# EAGLE design untitled (EAGLE 6.1)
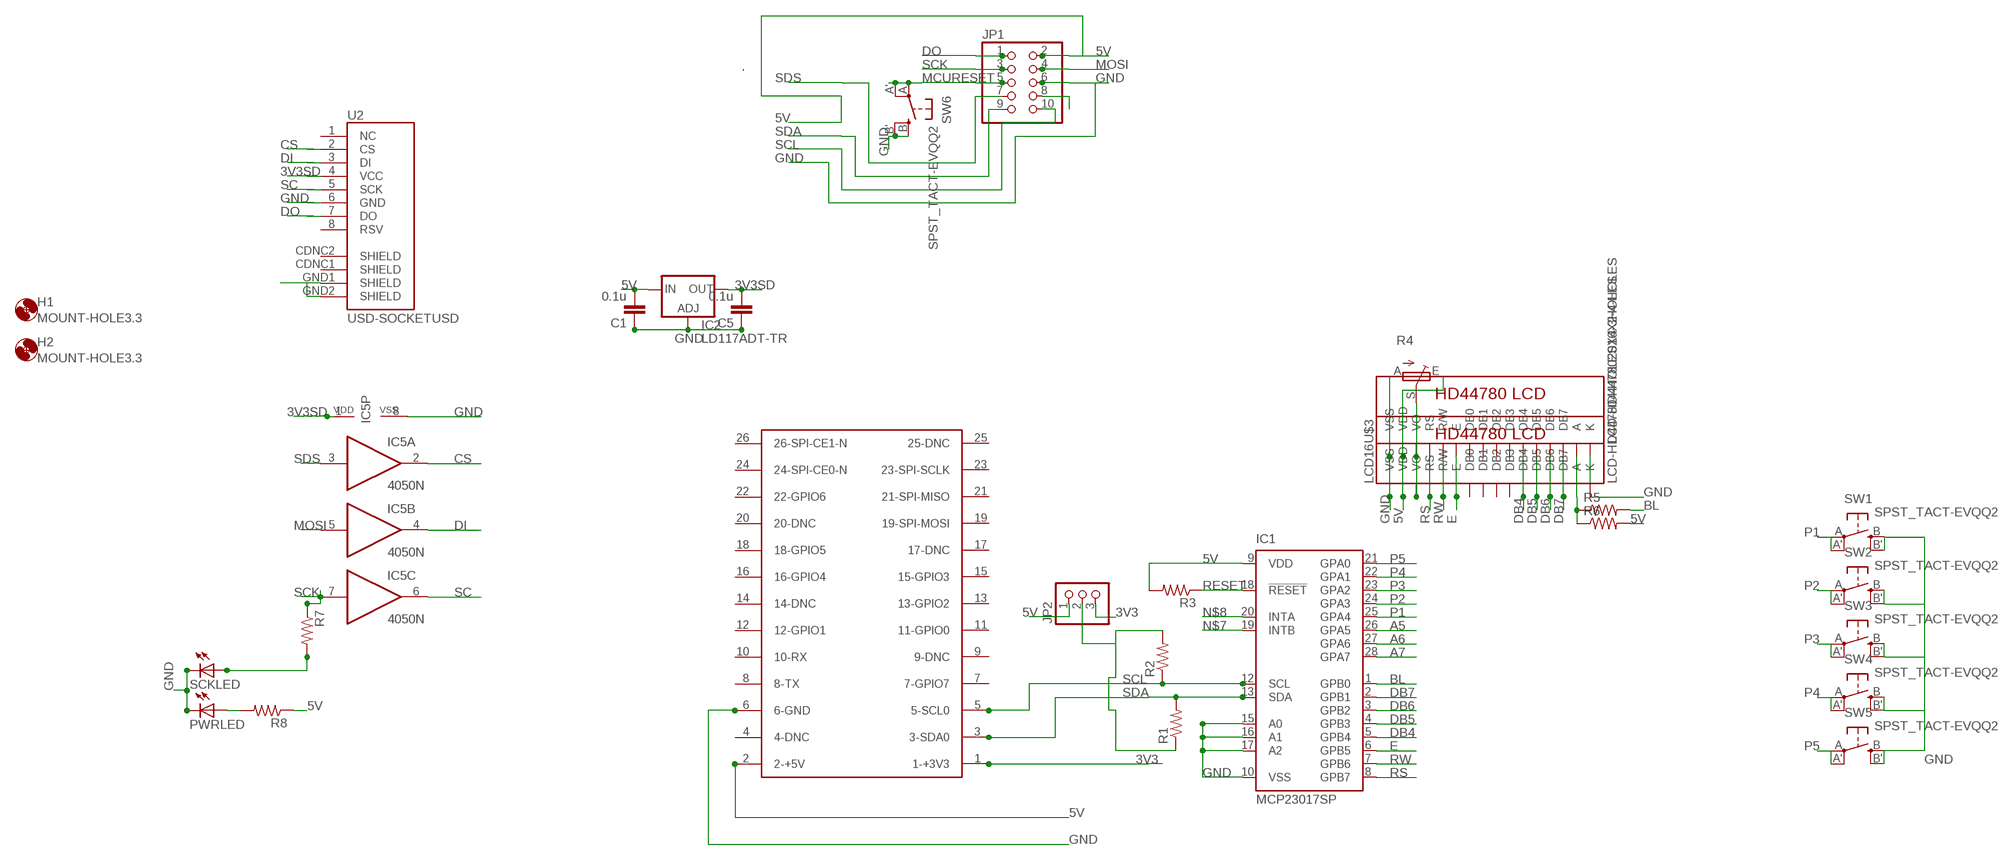
[diagram p0: schematic, sheet 1]

## Parts
C1  0.1u  CAPKIT  [CAP-PTH-SMALL-KIT]
C5  0.1u  CAPKIT  [CAP-PTH-SMALL-KIT]
H1  MOUNT-HOLE3.3  [3,3]
H2  MOUNT-HOLE3.3  [3,3]
IC1  MCP23017SP  [DIL28-3]
IC2  LD117ADT-TR  [DPACK]
IC5  4050N  [DIL16]
JP1  PINHD-2X5  [2X05]
JP2  PINHD-1X3  [1X03]
LCD16  LCD-HD447804-HOLES16X2-4-HOLES  [LCD-16X2-4HOLES]
PWRLED  LED1206  [LED-1206]
R1  R-US_0204/7  [0204/7]
R2  R-US_0204/7  [0204/7]
R3  R-US_0204/7  [0204/7]
R4  TRIM_EU-CA6V  [CA6V]
R5  R-US_0204/7  [0204/7]
R6  R-US_0204/7  [0204/7]
R7  R-US_0204/7  [0204/7]
R8  R-US_0204/7  [0204/7]
SCKLED  LED1206  [LED-1206]
SW1  SPST_TACT-EVQQ2  [EVQ-Q2]
SW2  SPST_TACT-EVQQ2  [EVQ-Q2]
SW3  SPST_TACT-EVQQ2  [EVQ-Q2]
SW4  SPST_TACT-EVQQ2  [EVQ-Q2]
SW5  SPST_TACT-EVQQ2  [EVQ-Q2]
SW6  SPST_TACT-EVQQ2  [EVQ-Q2]
U2  USD-SOCKETUSD  [USD-SOCKET-PP]
U$2  RASPBERRY-PI  [RASPBERRY-PI]
U$3  LCD-HD4478020X4-3HOLES  [LCD-20X4-3HOLES]

## Nets
3V3: JP2.3 U$2.1(1-+3V3)
3V3SD: C5.2 IC2.4(OUT) IC5.1(P:VDD) U2.4(VCC)
5V: C1.2 IC1.9(VDD) IC2.3(IN) JP1.2 JP2.1 LCD16.2(VDD) R3.2 R4.E R6.2 R8.1 U$2.2(2-+5V) U$3.P$2(VDD)
A5: IC1.26(GPA5)
A6: IC1.27(GPA6)
A7: IC1.28(GPA7)
BL: IC1.1(GPB0) R5.2
CS: IC5.2(A:O) U2.2(CS)
DB4: IC1.5(GPB4) LCD16.11(DB4) U$3.P$11(DB4)
DB5: IC1.4(GPB3) LCD16.12(DB5) U$3.P$12(DB5)
DB6: IC1.3(GPB2) LCD16.13(DB6) U$3.P$13(DB6)
DB7: IC1.2(GPB1) LCD16.14(DB7) U$3.P$14(DB7)
DI: IC5.4(B:O) U2.3(DI)
DO: JP1.1 U2.7(DO)
E: IC1.6(GPB5) LCD16.6(E) U$3.P$6(E)
GND: C1.1 C5.1 IC1.10(VSS) IC1.15(A0) IC1.16(A1) IC1.17(A2) IC2.1(ADJ) IC5.8(P:VSS) JP1.6 LCD16.1(VSS) LCD16.16(K) PWRLED.C R4.A SCKLED.C SW1.B'(S1) SW1.B(S) SW2.B'(S1) SW2.B(S) SW3.B'(S1) SW3.B(S) SW4.B'(S1) SW4.B(S) SW5.B'(S1) SW5.B(S) SW6.B'(S1) SW6.B(S) U2.6(GND) U2.GND1(SHIELD) U2.GND2(SHIELD) U$2.6(6-GND) U$3.P$1(VSS)
I2CPULL: JP2.2 R1.1 R2.2
MCURESET: JP1.5 SW6.A'(P1) SW6.A(P)
MOSI: IC5.5(B:I) JP1.4
N$1: LCD16.3(VO) R4.S U$3.P$3(VO)
N$2: LCD16.15(A) R5.1 R6.1 U$3.P$15(A)
N$3: JP1.8
N$4: U$3.P$16(K)
N$5: PWRLED.A R8.2
N$6: R7.2 SCKLED.A
N$7: IC1.19(INTB)
N$8: IC1.20(INTA)
P1: IC1.25(GPA4) SW1.A'(P1) SW1.A(P)
P2: IC1.24(GPA3) SW2.A'(P1) SW2.A(P)
P3: IC1.23(GPA2) SW3.A'(P1) SW3.A(P)
P4: IC1.22(GPA1) SW4.A'(P1) SW4.A(P)
P5: IC1.21(GPA0) SW5.A'(P1) SW5.A(P)
RESET: IC1.18(!RESET) R3.1
RS: IC1.8(GPB7) LCD16.4(RS) U$3.P$4(RS)
RW: IC1.7(GPB6) LCD16.5(R/W) U$3.P$5(R/W)
SC: IC5.6(C:O) U2.5(SCK)
SCK: IC5.7(C:I) JP1.3 R7.1
SCL: IC1.12(SCL) JP1.10 R2.1 U$2.5(5-SCL0)
SDA: IC1.13(SDA) JP1.9 R1.2 U$2.3(3-SDA0)
SDS: IC5.3(A:I) JP1.7
Unconnected: IC5.9(D:I) IC5.10(D:O) IC5.11(E:I) IC5.12(E:O) IC5.14(F:I) IC5.15(F:O) LCD16.7(DB0) LCD16.8(DB1) LCD16.9(DB2) LCD16.10(DB3) U2.1(NC) U2.8(RSV) U2.CDNC1(SHIELD) U2.CDNC2(SHIELD) U$2.4(4-DNC) U$2.7(7-GPIO7) U$2.8(8-TX) U$2.9(9-DNC) U$2.10(10-RX) U$2.11(11-GPIO0) U$2.12(12-GPIO1) U$2.13(13-GPIO2) U$2.14(14-DNC) U$2.15(15-GPIO3) U$2.16(16-GPIO4) U$2.17(17-DNC) U$2.18(18-GPIO5) U$2.19(19-SPI-MOSI) U$2.20(20-DNC) U$2.21(21-SPI-MISO) U$2.22(22-GPIO6) U$2.23(23-SPI-SCLK) U$2.24(24-SPI-CE0-N) U$2.25(25-DNC) U$2.26(26-SPI-CE1-N) U$3.P$7(DB0) U$3.P$8(DB1) U$3.P$9(DB2) U$3.P$10(DB3)

## Library data of the parts
C1 C5 = SparkFun-Passives:CAP: Capacitor Standard 0603 ceramic capacitor, and 0.1" leaded capacitor.
H1 H2 = holes:MOUNT-HOLE: MOUNTING HOLE with drill center marker
IC1 = adafruit:MCP23017: http://ww1.microchip.com/downloads/en/DeviceDoc/21952a.pdf Source: http://ww1.microchip.com/downloads/en/DeviceDoc/21952a.pdf
IC2 = v-reg:LD117A?*: Low drop fixed and adjustable positive voltage regulators 1 A Source: http://www.st.com/stonline/products/literature/ds/7194/ld1117axx.pdf
IC5 = 40xx:4050: Hex non-inverting BUFFER
JP1 = pinhead:PINHD-2X5: PIN HEADER
JP2 = pinhead:PINHD-1X3: PIN HEADER
LCD16 U$3 = HD44780LCD:LCD-HD44780
PWRLED SCKLED = LilyPad-Wearables:LED: LEDs Standard schematic elements and footprints for 5mm, 3mm, 1206, and 0603 sized LEDs. 5mm - Spark Fun Electronics SKU : Comp-SBL
R1-R3 R5-R8 = adafruit:R-US_: RESISTOR, American symbol
R4 = pot:TRIM_EU-: POTENTIOMETER
SW1-SW6 = adafruit:SPST_TACT: SMT 6mm switch, EVQQ2 series http://www.ladyada.net/library/eagle
U2 = SparkFun-Connectors_PETERMICROSDEBAY:USD-SOCKET: microSD Socket Push-push type uSD socket. Schematic element and footprint production proven. Spark Fun Electronics SKU : PRT-00127. tDoc lines correctly indicate media card edge positions when inserting (unlocked, locked, depressed).
U$2 = RaspberryPi:RASPBERRY-PI: Raspberry Pi Board <http://www.raspberrypi.org/> Jacques Lagnel V1.0 (beta) 2012 Board dimension: Forum 3D model <http://www.raspberrypi.org/forum/general-discussion/mechanical-profile-3d-models?value=3d%20model&type=1&include=1&search=1&ret=all> The GPIO Connector (P1): http://elinux.org/RPi_Low-level_peripherals

## Board
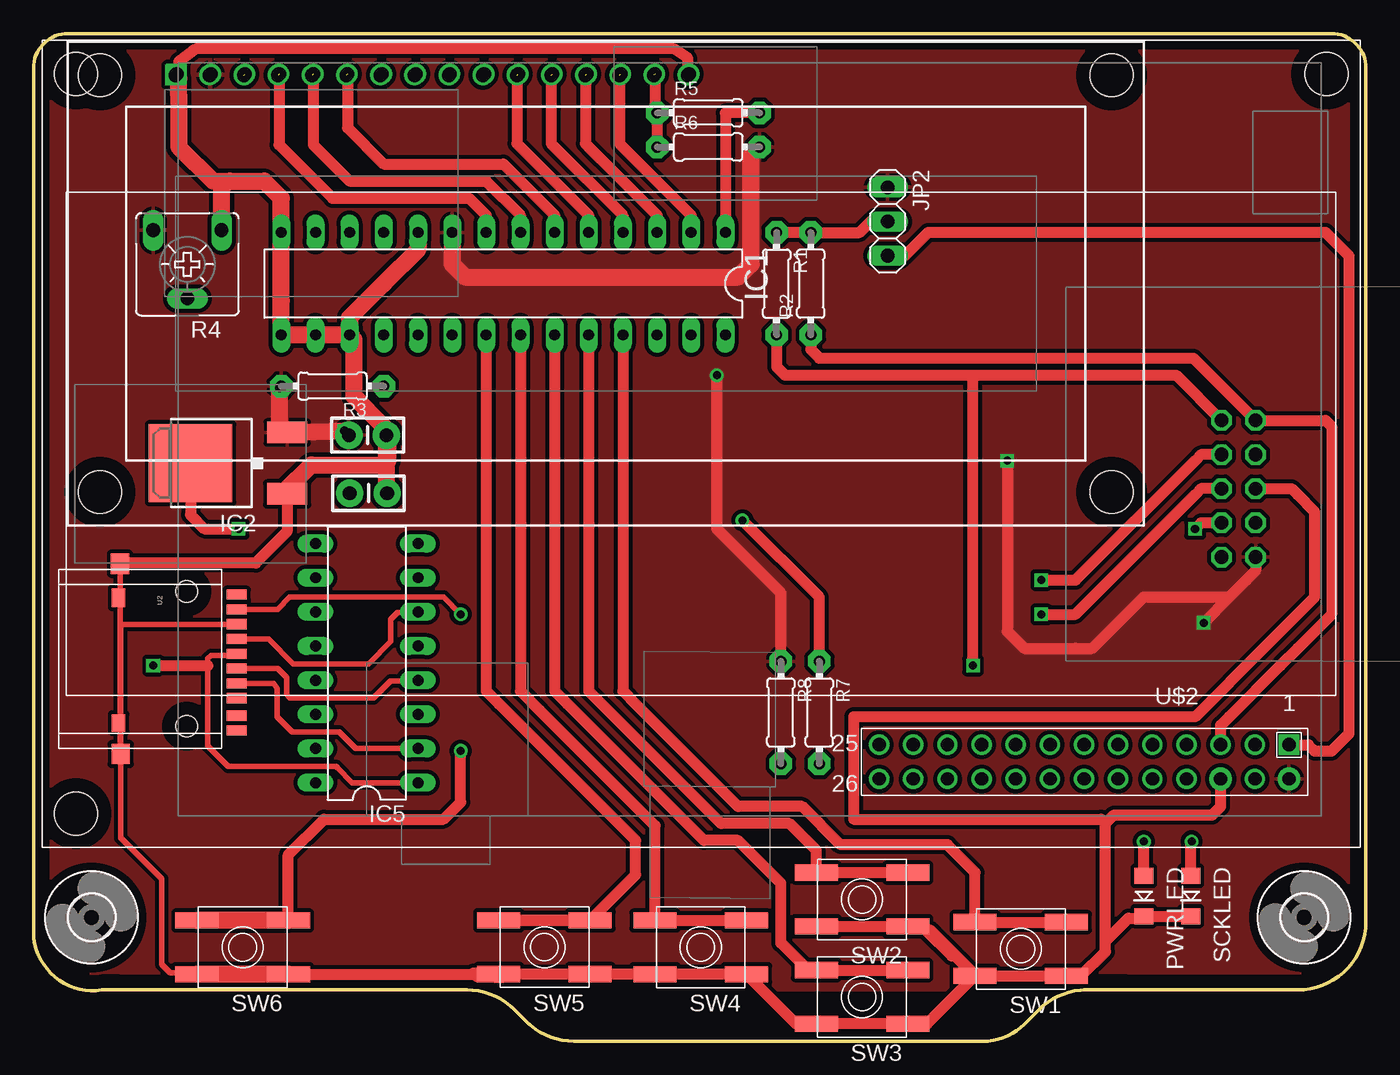
[diagram p1: board, top side]
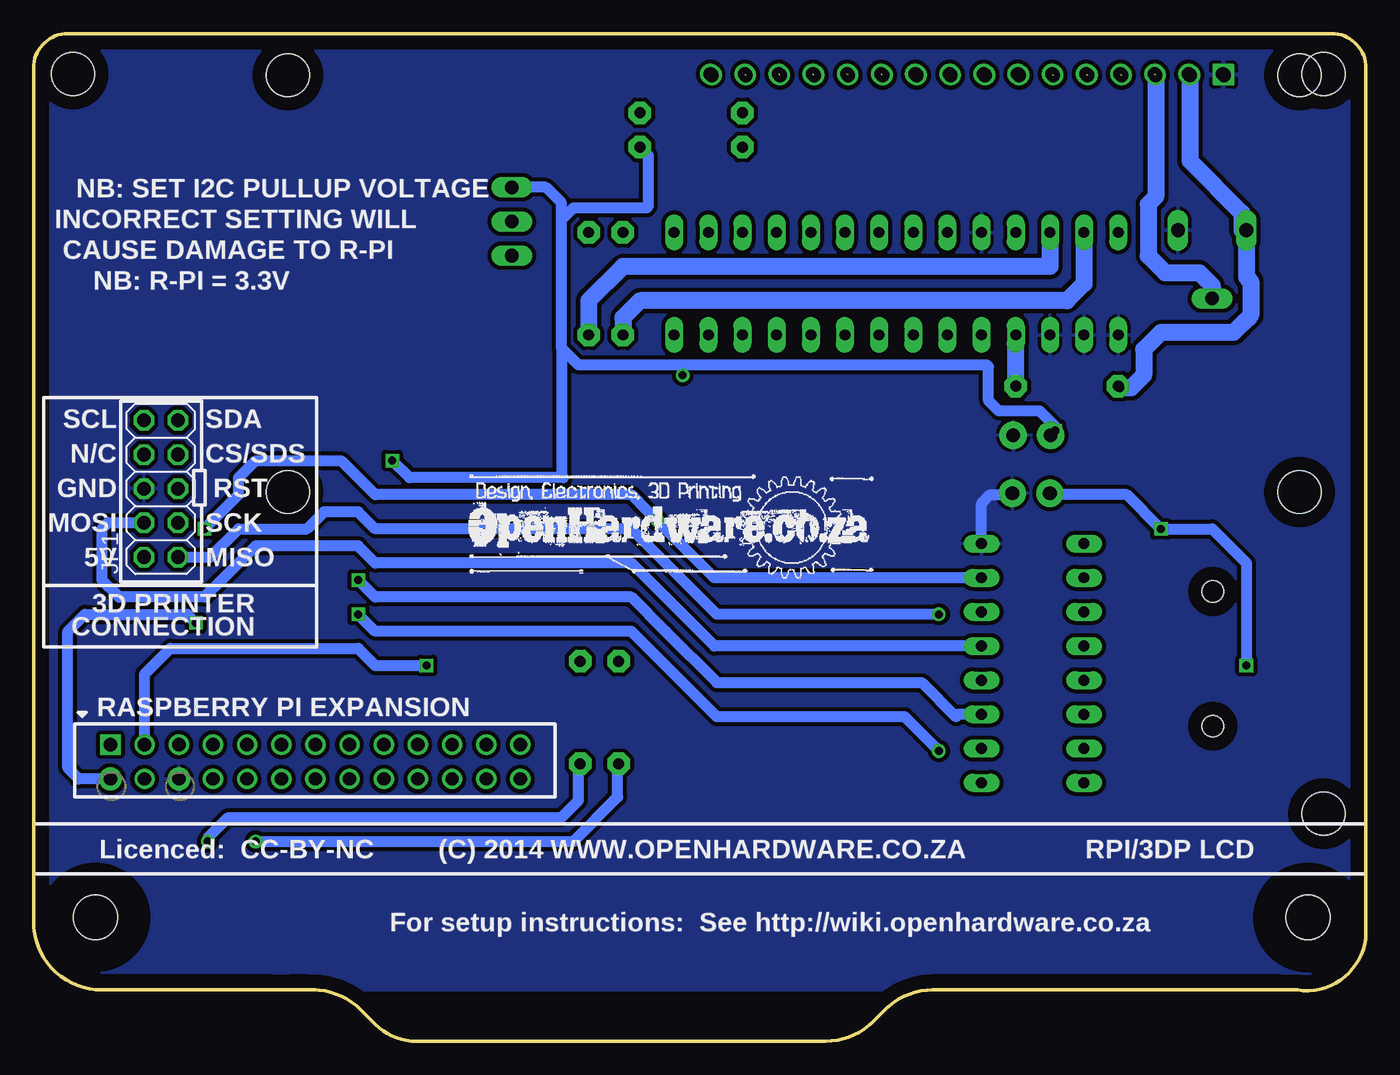
[diagram p2: board, bottom side, seen from below]

Size 99.06 x 74.93 mm. Coordinates in mm from the lower left corner, seen from the top.
Outline: 3.81,74.93 95.25,74.93
Outline: 95.25,74.93 3.81,74.93
Outline: 3.81,74.93 2.54,74.93 arc90 0,72.39 0,7.62 arc90 5.08,3.81 6.35,3.81 20.32,3.81
Outline: 20.32,3.81 31.75,3.81
Outline: 80.01,3.81 81.28,3.81 93.98,3.81 arc90 99.06,8.89 99.06,72.39 arc90 96.52,74.93 95.25,74.93
Outline: 20.32,3.81 32.22,3.81 arc-45 35.75,2.35 36.83,1.27
Outline: 78.27,3.81 arc45 74.74,2.35 73.66,1.27 arc-45 70.59,0 69.85,0 41.91,0 40.17,0 arc-45 36.64,1.46 35.56,2.54
Outline: 78.74,3.81 80.01,3.81
Outline: 80.01,3.81 78.11,3.81
Copper layers (1*16): Top 0.035mm / dielectric 1.5mm / Bottom 0.035mm
Design rules: minimum track width 10mil, minimum drill 24mil, track to track 12mil, track to pad 12mil, pad to pad 12mil, via to via 12mil, smd to smd 12mil, copper to edge 40mil, drill to drill 8mil, minimum pad ring 10mil, minimum via ring 8mil, stop-mask expansion 4mil, vias tented up to drill 0mil, thermal gap 10mil

### Footprints (pad centres in the part's own frame; a part is rotated, then mirrored left to right if it is on the bottom)
CAP-PTH-SMALL-KIT = drill 1.016 pad 2.032: 1 -1.397,0; 2 1.397,0
3,3 = hole 3.3: 0,0
DIL28-3 = drill 0.813 long: 1 -16.51,-3.81; 2 -13.97,-3.81; 3 -11.43,-3.81; 4 -8.89,-3.81; 5 -6.35,-3.81; 6 -3.81,-3.81; 7 -1.27,-3.81; 8 1.27,-3.81; 9 3.81,-3.81; 10 6.35,-3.81; 11 8.89,-3.81; 12 11.43,-3.81; 13 13.97,-3.81; 14 16.51,-3.81; 15 16.51,3.81; 16 13.97,3.81; 17 11.43,3.81; 18 8.89,3.81; 19 6.35,3.81; 20 3.81,3.81; 21 1.27,3.81; 22 -1.27,3.81; 23 -3.81,3.81; 24 -6.35,3.81; 25 -8.89,3.81; 26 -11.43,3.81; 27 -13.97,3.81; 28 -16.51,3.81
DPACK = smd 1.6 x 3: 1 -2.28,-4.8; 3 2.28,-4.8 | smd 5.8 x 6.2: 4 0,2.38
DIL16 = drill 0.813 long: 1 -8.89,-3.81; 2 -6.35,-3.81; 3 -3.81,-3.81; 4 -1.27,-3.81; 5 1.27,-3.81; 6 3.81,-3.81; 7 6.35,-3.81; 8 8.89,-3.81; 9 8.89,3.81; 10 6.35,3.81; 11 3.81,3.81; 12 1.27,3.81; 13 -1.27,3.81; 14 -3.81,3.81; 15 -6.35,3.81; 16 -8.89,3.81
2X05 = drill 1.016 octagon: 1 -5.08,-1.27; 2 -5.08,1.27; 3 -2.54,-1.27; 4 -2.54,1.27; 5 0,-1.27; 6 0,1.27; 7 2.54,-1.27; 8 2.54,1.27; 9 5.08,-1.27; 10 5.08,1.27
1X03 = drill 1.016 long: 1 -2.54,0; 2 0,0; 3 2.54,0
LCD-16X2-4HOLES = drill 1.016 square: 1 -32,15.5 | drill 1.016: 2 -29.46,15.5; 3 -26.92,15.5; 4 -24.38,15.5; 5 -21.84,15.5; 6 -19.3,15.5; 7 -16.76,15.5; 8 -14.22,15.5; 9 -11.68,15.5; 10 -9.14,15.5; 11 -6.6,15.5; 12 -4.06,15.5; 13 -1.52,15.5; 14 1.02,15.5; 15 3.56,15.5; 16 6.1,15.5 | hole 3.2: -37.6,15.5; -37.6,-15.5; 37.6,-15.5; 37.6,15.5
LED-1206 = smd 1.2 x 1.4: A -1.5,0; C 1.5,0
0204/7 = drill 0.813 pad 1.676 octagon: 1 -3.81,0; 2 3.81,0
CA6V = drill 1.016 long: A -2.54,-2.54; E 2.54,-2.54; S 0,2.54
EVQ-Q2 = smd 3.2 x 1.2: A -3.4,-2; A' 3.4,-2; B -3.4,2; B' 3.4,2
USD-SOCKET-PP = smd 0.75 x 1.5: 1 2.925,1.125; 2 1.825,1.125; 3 0.725,1.125; 4 -0.375,1.125; 5 -1.475,1.125; 6 -2.575,1.125; 7 -3.675,1.125; 8 -4.775,1.125; CD1 5.325,1.125; CD2 4.225,1.125 | smd 1.4 x 1: CDNC1 -4.55,-7.65 | smd 1.3 x 1: CDNC2 4.775,-7.65 | smd 1.5 x 1.35: GND1 -7.075,-7.55; GND2 7.075,-7.5 | hole 1.6: -5,-2.6; 5,-2.6
RASPBERRY-PI = drill 1 square: 1 0,0 | drill 1 pad 1.676: 2 0,2.54; 6 5.08,2.54 | drill 1: 3 2.54,0; 4 2.54,2.54; 5 5.08,0; 7 7.62,0; 8 7.62,2.54; 9 10.16,0; 10 10.16,2.54; 11 12.7,0; 12 12.7,2.54; 13 15.24,0; 14 15.24,2.54; 15 17.78,0; 16 17.78,2.54; 17 20.32,0; 18 20.32,2.54; 19 22.86,0; 20 22.86,2.54; 21 25.4,0; 22 25.4,2.54; 23 27.94,0; 24 27.94,2.54; 25 30.48,0; 26 30.48,2.54
LCD-20X4-3HOLES = drill 1.016 square: P$1 10,57.5 | drill 1.016: P$2 12.54,57.5; P$3 15.08,57.5; P$4 17.62,57.5; P$5 20.16,57.5; P$6 22.7,57.5; P$7 25.24,57.5; P$8 27.78,57.5; P$9 30.32,57.5; P$10 32.86,57.5; P$11 35.4,57.5; P$12 37.94,57.5; P$13 40.48,57.5; P$14 43.02,57.5; P$15 45.56,57.5; P$16 48.1,57.5 | hole 3.2: 2.5,2.5; 2.5,57.5; 95.5,57.5

### Placement (x,y rotation side)
C1  24.83,45.07 180 top
C5  24.89,40.75 180 top
H1  4.31,9.21 180 top
H2  94.47,9.21 0 top
IC1  34.93,56.34 180 top
IC2  14.05,42.99 90 top
IC5  24.76,28.12 90 top
JP1  89.6,41.08 90 bottom
JP2  63.5,60.96 270 top
LCD16  42.55,56.34 0 top
PWRLED  82.55,10.79 270 top
R1  55.25,56.34 270 top
R2  57.79,56.34 90 top
R3  22.23,48.72 180 top
R4  11.43,57.77 180 top
R5  50.17,69.04 0 top
R6  50.17,66.5 0 top
R7  58.42,24.45 270 top
R8  55.56,24.45 270 top
SCKLED  86.04,10.79 270 top
SW1  73.41,6.86 180 top
SW2  61.6,10.54 180 top
SW3  61.6,3.29 180 top
SW4  49.6,6.99 180 top
SW5  37.99,7 180 top
SW6  15.54,6.99 180 top
U2  13.97,28.43 270 top
U$2  93.35,22.05 180 top
U$3  0.64,14.43 0 top

### Tracks (layer width: path | path; a pad name or v marks a point on that pad's centre or on a via)
3V3
  Top 0.813: U$2.1 94.79,22.05 95.25,21.59 96.52,21.59 97.79,22.86 97.79,58.42 96.06,60.15 66.5,60.15 64.77,58.42 JP2.3
3V3SD  (via drill 0.6)
  Top 0.406: IC5.1 23.7,19.23 22.61,20.32 22.48,20.45 14.48,20.45 12.95,21.97 12.95,27.94 12.95,28.45 13.21,28.7 14.99,28.7 U2.4
  Top 0.813: IC2.4 11.67,39.13 12.7,38.1 v15.24,38.1 | v8.89,27.94 12.7,27.94 12.95,27.94
  Bottom 0.813: C5.2 23.38,40.64 17.78,40.64 v15.24,38.1 11.43,38.1 8.89,35.56 v8.89,27.94
5V  (via drill 0.6)
  Top 0.813: R8.1 55.56,33.34 50.8,38.1 v50.8,49.53 | v72.39,43.18 72.39,30.48 73.66,29.21 77.47,29.21 78.74,29.21 82.55,33.02 88.9,33.02 | v87,31.11 88.9,33.02 | 88.9,33.02 90.17,34.29 90.87,34.99 JP1.2 | U$2.2 93.52,19.51
  Top 1.27: v18.27,48.58 18.27,45.84 IC2.3 v23.11,45.4 C1.2 | IC1.9 31.12,57.78 32.07,56.83 52.39,56.83 53.34,57.78 53.34,65.86 R6.2
  Bottom 0.813: v23.11,45.4 23.11,45.71 24.26,46.86 27.3,46.86 28.07,47.62 28.07,50.16 28.19,50.29 50.8,50.29 | 50.8,50.29 58.55,50.29 59.82,51.56 | 59.82,51.56 59.82,61.09 | 59.82,61.09 58.93,61.98 53.47,61.98 53.34,62.1 53.34,65.86 R6.2 | v50.8,49.53 50.8,50.29 | 59.82,51.56 59.82,42.04 59.69,41.91 71.12,41.91 v72.39,43.18 | U$2.2 95.71,19.51 96.52,20.32 96.52,30.48 95.25,31.75 87.63,31.75 v87,31.11 | 59.82,61.09 59.82,62.36 60.96,63.5 JP2.1
  Bottom 1.27: LCD16.2 13.09,65.47 9.21,61.59 9.21,60.31 R4.E 8.89,56.83 8.57,56.51 8.57,53.97 9.21,53.34 9.84,52.7 15.24,52.7 16.51,51.43 16.51,49.53 17.46,48.58 v18.27,48.58 R3.2
  pour Top: 2.54,74.93 arc90 0,72.39 0,7.94 0.32,7.94 arc-90 4.45,3.81 94.06,3.81 arc90 99.06,8.81 99.06,9.53 99.06,72.71 98.74,72.71 arc-90 96.52,74.93
BL
  Top 0.813: R5.2 51.44,69.04 IC1.1
CS
  Top 0.406: U2.2 17.84,26.61 18.1,26.23 18.1,24.13 | 18.1,24.13 18.73,23.5 19.05,23.18 19.24,22.99 | 19.24,22.99 19.37,22.99 | IC5.2 23.95,21.77 22.73,22.99 19.37,22.99 | 19.37,22.99 19.24,22.99 | 19.24,22.99 18.1,24.13
DB4  (1 unrouted)
  Top 0.813: LCD16.11 35.95,66.75 41.28,61.42 IC1.5
DB5  (1 unrouted)
  Top 0.813: LCD16.12 38.49,66.75 43.82,61.42 IC1.4
DB6  (1 unrouted)
  Top 0.813: IC1.3 46.35,61.42 43.18,64.59 | 43.18,64.59 41.28,66.5 | LCD16.13 41.03,66.75 43.18,64.59
DB7  (1 unrouted)
  Top 0.813: LCD16.14 43.57,66.75 48.9,61.42 IC1.2
DI
  Top 0.406: U2.3 18.14,27.71 18.8,27.05 18.8,25.78 19.05,25.53 25.27,25.53 26.54,26.8 28.52,26.8 IC5.4
DO  (via drill 0.6)
  Top 0.406: U2.7 18.14,32.11 19.05,33.02 30.48,33.02 v31.75,31.75
  Bottom 0.813: v31.75,31.75 48.26,31.75 52.07,35.56 54.61,38.1 73.66,38.1 74.93,39.37 77.47,39.37 78.74,38.1 83.82,38.1 85.92,36 JP1.1
E  (1 unrouted)
  Top 0.813: U$3.P$6 23.34,67.93 26.04,65.23 34.92,65.23 38.74,61.42 IC1.6
GND
  Top 0.406: U2.GND1 6.42,21.41 U2.GND2 | U2.GND2 6.47,31 6.48,31.01 U2.6 | U2.GND2 6.47,15.12 9.53,12.07 9.53,5.71 10.16,5.08 12.05,5.08 SW6.B'
  Top 0.813: LCD16.16 48.65,73.1 47.63,73.8 12.07,73.8 10.8,72.85 10.8,72.09 U$3.P$1 | SW1.B' 66.44,1.29 SW3.B SW3.B' 56.7,1.29 SW4.B SW4.B' 41.4,4.98 SW5.B SW5.B' 34.5,5.08 32.7,5.08 33.02,4.76 34.92,4.76 34.29,4.76 34.07,4.98 SW6.B | 66.07,8.54 SW2.B SW2.B' 66.07,8.54 | 66.07,8.54 66.36,8.26 | 66.36,8.26 68.26,6.35 68.52,6.35 SW1.B' | SW1.B' 76.1,4.86 76.2,4.76 76.71,4.76 SW1.B 77.89,4.86 79.69,6.67 | 79.69,6.67 79.69,16.19 | 79.69,16.19 80.33,16.83 87.63,16.83 88.27,17.46 U$2.6 | 66.07,8.54 66.36,8.26 | 66.36,8.26 66.67,8.26 69.85,5.08 | 79.69,6.67 79.69,7.43 81.41,9.14 82.4,9.14 PWRLED.C SCKLED.C | IC2.1 18.85,37.9 16.51,35.56 6.47,35.56 U2.GND1 | 79.69,16.19 79.38,16.51 60.96,16.51 60.96,17.78 60.96,24.13 86.36,24.13 91.44,29.21 92.71,30.48 95.25,33.02 95.25,39.37 93.98,40.64 93.53,41.08 JP1.6
  Top 1.27: IC1.10 28.58,58.88 26.04,56.34 23.5,53.8 IC1.17 | IC1.17 IC1.16 IC1.15 18.42,55.07 18.42,62.69 17.14,63.96 14.61,63.96 | LCD16.1 10.8,71.59 10.8,70.31 10.8,66.5 13.34,63.96 14.61,63.96 | SW6.B SW6.B' | R4.A 13.97,63.64 14.61,63.96 | IC2.1 18.72,40.95 20.64,42.86 26.04,42.86 26.35,43.18 26.35,44.94 C1.1 | C1.1 26.23,40.82 C5.1 | C1.1 26.23,45.53 24.77,46.99 23.81,47.94 23.81,52.21 IC1.17
  Bottom 0.813: IC5.8 28.57,40.01 27.94,40.64 26.4,40.64 C5.1
  pour Bottom: 96.52,74.93 arc-90 99.06,72.39 99.06,8.89 arc90 94.3,4.13 94.3,3.81 4.45,3.81 arc-90 0,8.26 0,72.39 arc90 2.54,74.93
I2CPULL
  Top 0.813: R1.1 R2.2 61.42,60.15 62.23,60.96 JP2.2
MCURESET  (via drill 0.6)
  Top 0.813: SW6.A 18.94,13.86 21.59,16.51 30.48,16.51 31.75,17.78 v31.75,21.59 | v74.93,31.75 77.47,31.75 86.36,40.64 86.81,41.08 JP1.5
  Top 1.27: SW6.A SW6.A'
  Bottom 0.813: v31.75,21.59 34.29,24.13 48.26,24.13 52.07,27.94 54.61,30.48 73.66,30.48 v74.93,31.75
MOSI
  Bottom 0.813: IC5.5 48.44,29.39 52.07,33.02 54.61,35.56 73.66,35.56 74.93,36.83 82.55,36.83 85.09,34.29 86.36,33.02 92.71,33.02 93.98,34.29 93.98,38.1 93.53,38.54 JP1.4
N$1  (1 unrouted)
  Bottom 1.27: LCD16.3 15.63,62.8 16.19,62.23 16.19,58.42 14.92,57.15 12.38,57.15 11.43,56.2 R4.S
N$2  (1 unrouted)
  Top 0.813: U$3.P$15 46.2,69.2 R5.1 R6.1
N$5  (via drill 0.6)
  Top 0.813: PWRLED.A v82.55,14.86
  Bottom 0.813: v82.55,14.86 58.93,14.86 55.63,18.16 55.63,20.57 R8.2
N$6  (via drill 0.6)
  Top 0.813: SCKLED.A 86.04,14.8 v86.11,14.86
  Bottom 0.813: v86.11,14.86 86.11,15.11 84.58,16.64 59.82,16.64 58.55,17.91 58.55,20.51 R7.2
P1
  Top 0.813: SW1.A SW1.A' 70,12.54 67.94,14.61 65.41,14.61 63.5,14.61 60.01,14.61 57.15,17.46 52.39,17.46 44.77,25.08 43.82,26.04 IC1.25
P2
  Top 0.813: SW2.A SW2.A' 58.2,14.19 56.2,16.19 51.12,16.19 42.23,25.08 41.28,26.04 IC1.24
P3
  Top 0.813: SW3.A SW3.A' 57.56,5.3 55.56,7.3 55.56,11.75 52.39,14.92 49.85,14.92 39.69,25.08 38.74,26.04 IC1.23
P4
  Top 0.813: SW4.A SW4.A' 46.2,16.03 37.62,24.61 | 37.62,24.61 37.15,25.08 | IC1.22 36.2,26.04 37.62,24.61
P5
  Top 0.813: SW5.A SW5.A' SW5.A 43.5,11.11 44.77,12.38 44.77,14.92 35.56,24.13 | 35.56,24.13 34.61,25.08 | IC1.21 33.66,26.04 35.56,24.13
RESET
  Bottom 1.27: R3.1 IC1.18
RS  (1 unrouted)
  Top 0.813: U$3.P$4 18.26,66.66 22.23,62.69 32.39,62.69 33.66,61.42 IC1.8
RW  (1 unrouted)
  Top 0.813: U$3.P$5 20.8,66.66 23.5,63.96 33.66,63.96 36.2,61.42 IC1.7
SC
  Top 0.406: U2.5 17.46,29.91 19.3,28.07 24.89,28.07 26.54,29.72 26.54,31.37 27.05,31.88 28.52,31.88 IC5.6
SCK  (via drill 0.6)
  Top 0.813: R7.1 58.42,33.02 v52.7,38.73 | JP1.3 86.81,38.54 v86.36,38.1
  Bottom 0.813: IC5.7 48.44,34.47 50.8,36.83 | 50.8,36.83 52.07,38.1 | 50.8,36.83 v52.7,38.73 | v52.7,38.73 53.34,39.37 | 53.34,39.37 54.61,40.64 73.66,40.64 74.93,41.91 76.2,43.18 82.55,43.18 83.82,41.91 83.82,40.64 v86.36,38.1 | v52.7,38.73 53.34,39.37
SCL
  Top 0.813: R2.1 57.78,51.43 58.42,50.8 86.23,50.8 JP1.10 96.08,46.16 96.52,45.72 96.52,31.75 93.98,29.21 92.71,27.94 88.9,24.13 88.27,23.5 U$2.5
  Bottom 1.27: IC1.12 23.5,57.61 55.24,57.61 57.78,55.07 R2.1
SDA  (via drill 0.6)
  Top 0.813: R1.2 55.24,50.16 55.88,49.53 69.85,49.53 | 69.85,49.53 84.96,49.53 JP1.9 | v69.85,27.94 69.85,49.53
  Bottom 0.813: U$2.3 90.81,27.3 88.9,29.21 74.93,29.21 73.66,27.94 v69.85,27.94
  Bottom 1.27: IC1.13 20.96,56.34 22.23,55.07 53.98,55.07 55.24,53.8 R1.2
SDS  (via drill 0.6)
  Top 0.813: v74.93,34.29 77.47,34.29 86.36,43.18 86.81,43.62 JP1.7
  Bottom 0.813: IC5.3 30.3,24.31 30.48,24.13 33.02,26.67 48.26,26.67 52.07,30.48 54.61,33.02 73.66,33.02 v74.93,34.29

### Text on the board
bPlace: NB: SET I2C PULLUP VOLTAGE | INCORRECT SETTING WILL | CAUSE DAMAGE TO R-PI | NB: R-PI = 3.3V | SDA | SCL | CS/SDS | N/C | RST | GND | SCK | MOSI | MISO | 5V | 3D PRINTER | CONNECTION | RASPBERRY PI EXPANSION | RPI/3DP LCD | WWW.OPENHARDWARE.CO.ZA | (C) 2014 | Licenced: CC-BY-NC | For setup instructions: See http://wiki.openhardware.co.za
OPENHWSILK: LCD | I2C | 5V | VCC | 3DP | NB: OR not AND | 220R | 4K7 | 4K7 | MCP23017 | RPi | 3.3V | I2C Pullup Voltage | CONTRAST | 3DP | 10k | 3V3 | SDA | SCL | 0.1u | CS/ | SDS | RST | GND | 0.1u | SCK | MOSI | SD CARD | MISO | 5V | 4050 | CONNECTOR | ON REVERSE | RPi | LEDR | LEDR | RESET | MENU | BACK | ENTER | PWR | SD